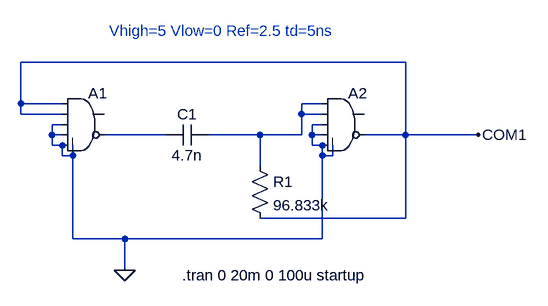
[diagram p0: schematic Multivibrateur-astable-NAND.asc]
Multivibrateur-astable-NAND.asc, the LTspice schematic file:
Version 4.1
SHEET 1 880 680
WIRE 576 32 -16 32
WIRE -16 96 -16 32
WIRE 48 96 -16 96
WIRE 448 96 416 96
WIRE -16 112 -16 96
WIRE 48 112 -16 112
WIRE 416 112 416 96
WIRE 448 112 416 112
WIRE 48 128 32 128
WIRE 448 128 432 128
WIRE 32 144 32 128
WIRE 48 144 32 144
WIRE 208 144 112 144
WIRE 352 144 272 144
WIRE 416 144 416 112
WIRE 416 144 352 144
WIRE 432 144 432 128
WIRE 448 144 432 144
WIRE 576 144 576 32
WIRE 576 144 512 144
WIRE 688 144 576 144
WIRE 32 160 32 144
WIRE 48 160 32 160
WIRE 432 160 432 144
WIRE 448 160 432 160
WIRE 48 176 48 160
WIRE 64 176 64 160
WIRE 64 176 48 176
WIRE 448 176 448 160
WIRE 464 176 464 160
WIRE 464 176 448 176
WIRE 352 192 352 144
WIRE 576 272 576 144
WIRE 576 272 352 272
WIRE 64 304 64 176
WIRE 144 304 64 304
WIRE 448 304 448 176
WIRE 448 304 144 304
WIRE 144 352 144 304
FLAG 144 352 0
FLAG 688 144 COM1
SYMBOL cap 272 128 R90
WINDOW 0 0 32 VBottom 2
WINDOW 3 32 32 VTop 2
SYMATTR InstName C1
SYMATTR Value 4.7n
SYMATTR SpiceLine V=5
SYMBOL res 336 176 R0
SYMATTR InstName R1
SYMATTR Value 96.833k
SYMBOL Digital\\and 80 64 R0
WINDOW 3 16 52 Invisible 2
SYMATTR Value Vhigh=5 Vlow=0 Ref=2.5
SYMATTR InstName A1
SYMBOL Digital\\and 480 64 R0
WINDOW 3 16 112 Invisible 2
SYMATTR Value Vhigh=5 Vlow=0 Ref=2.5 td=5ns
SYMATTR InstName A2
TEXT 232 360 Left 2 !.tran 0 20m 0 100u startup
TEXT 120 -16 Left 2 ;Vhigh=5 Vlow=0 Ref=2.5 td=5ns

The netlist it stands for:
* Multivibrateur-astable-NAND.asc
C1 N001 N002 4.7n V=5
R1 N001 COM1 96.833k
A1 COM1 COM1 0 0 0 N002 0 0 AND Vhigh=5 Vlow=0 Ref=2.5
A2 N001 N001 0 0 0 COM1 0 0 AND Vhigh=5 Vlow=0 Ref=2.5 td=5ns
.tran 0 20m 0 100u startup
* Vhigh=5 Vlow=0 Ref=2.5 td=5ns
.backanno
.end